# Altium project RGB-mic.PrjPcb
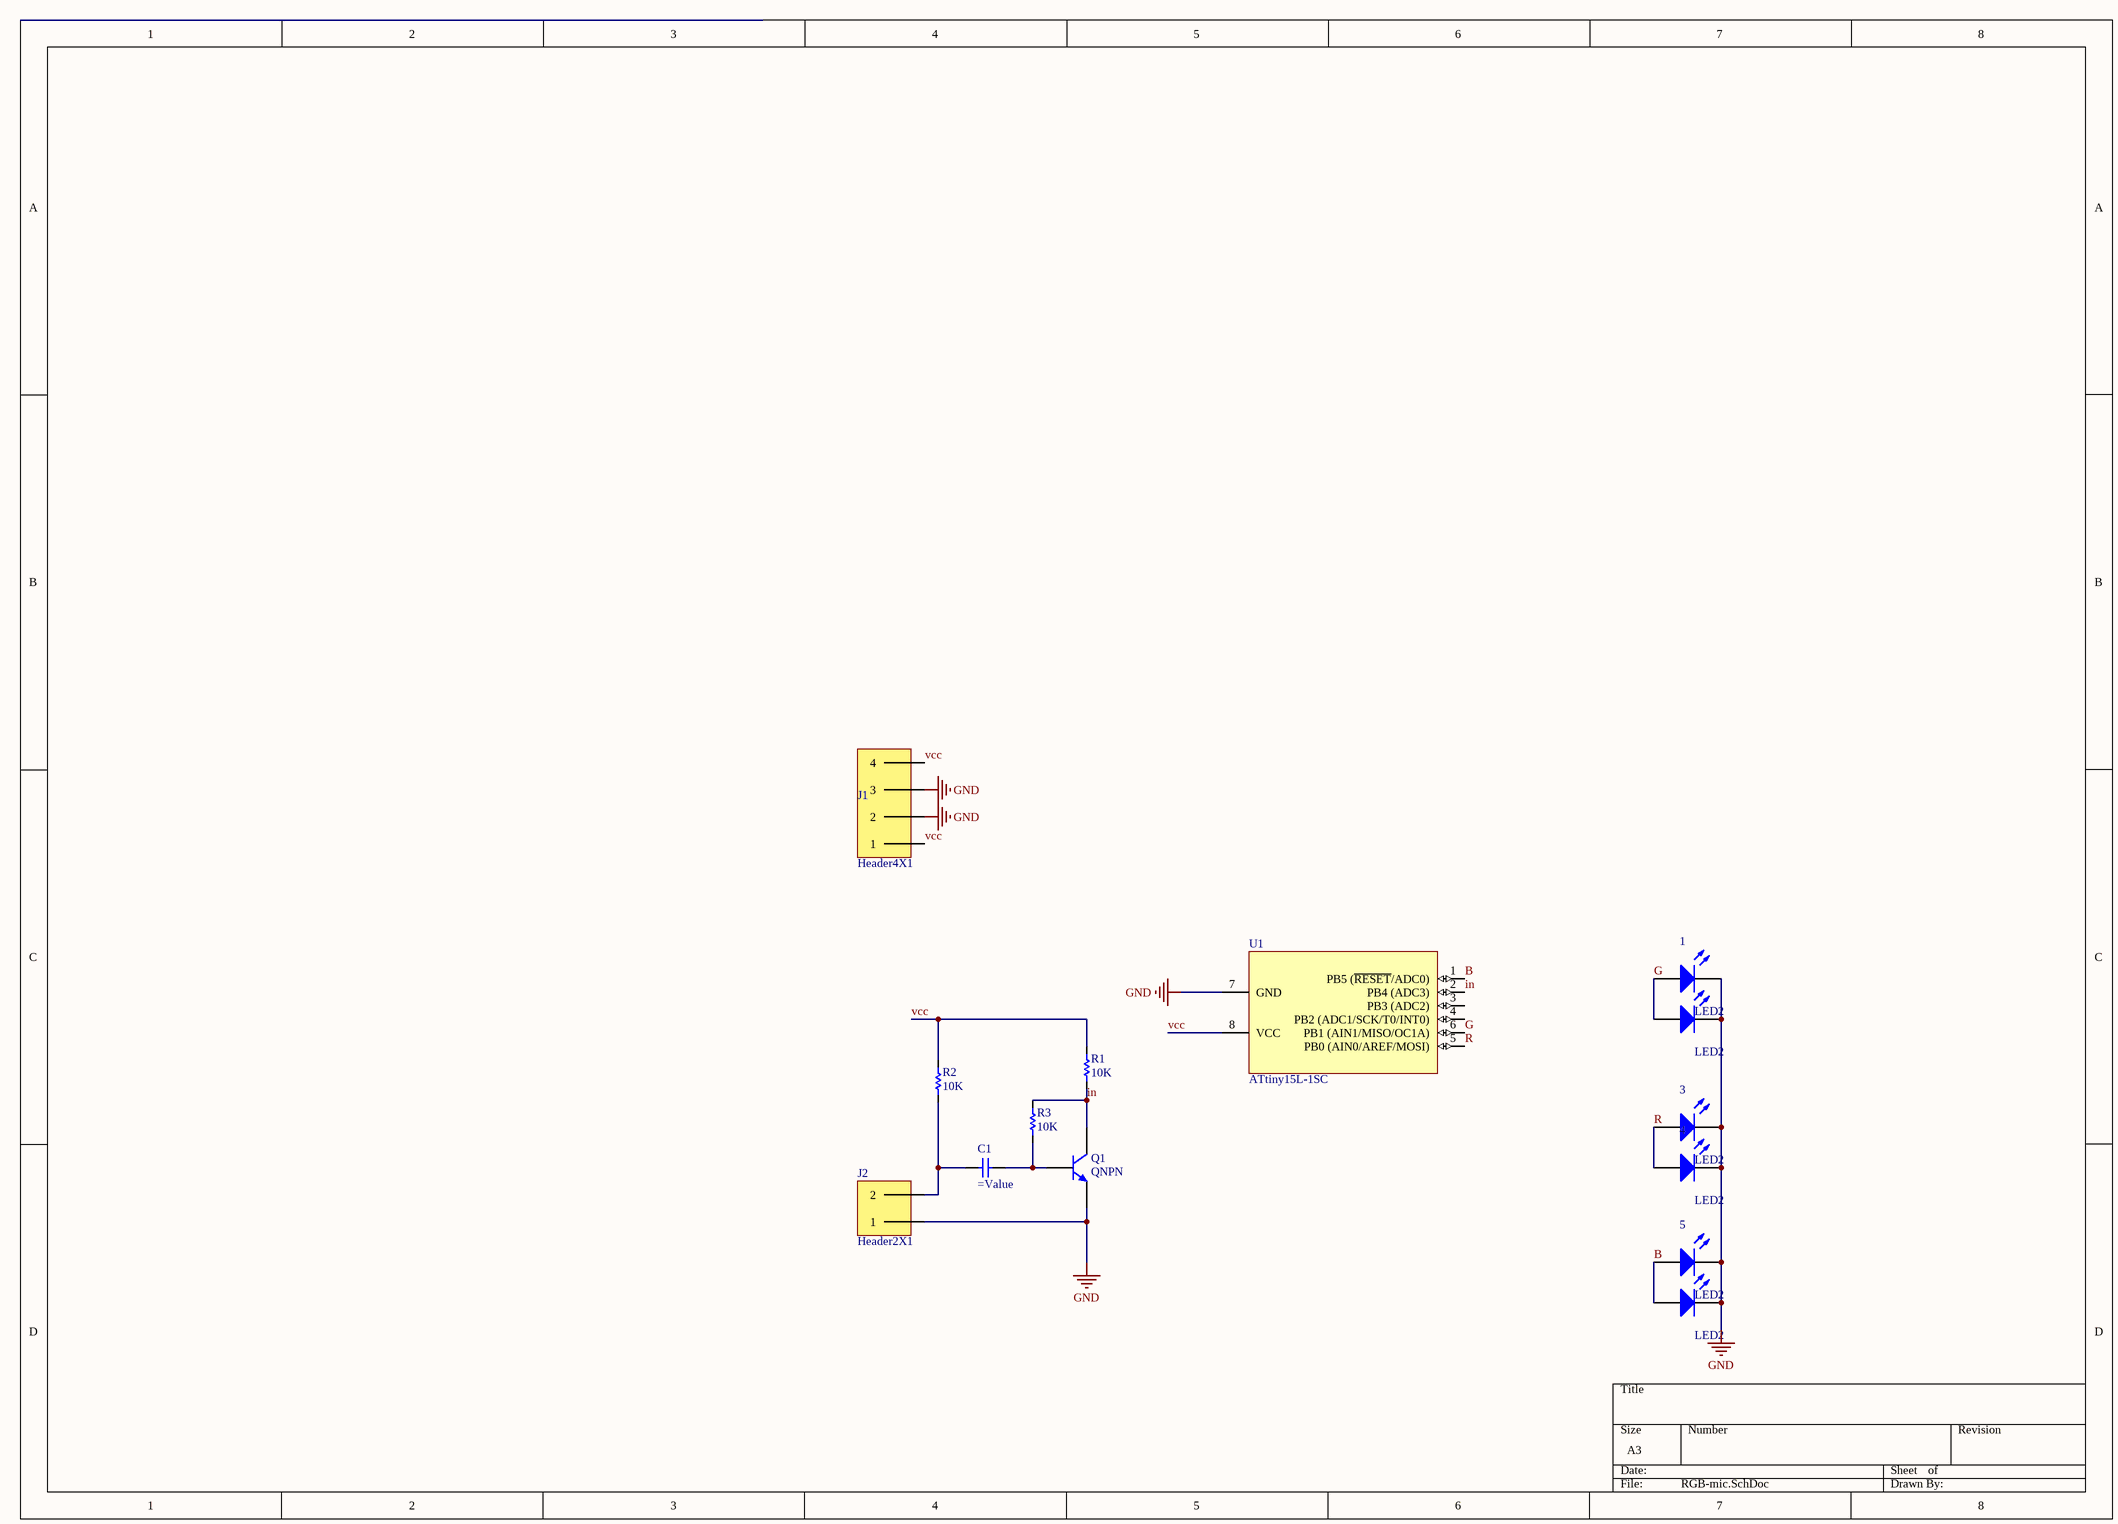
[diagram p0: RGB-mic.SchDoc]
1 sheet, 14 parts. Net scope: global (net labels, ports and power ports of the same name join across sheets).
Board file: RGB-mic.PcbDoc

## Sheet RGB-mic.SchDoc
size A3; SPICEModelCacheRLVYLVLF: <root> / <DocumentId>RLVYLVLF</DocumentId> / <CacheFrame Number="0"> / <Model Name="qnpn" Kind="MDL"> / <Text>*QNPN / *NPN Trans Pinout: C,B,E / .MODEL QNPN NPN(IS=3.2E-16 BF=141 VAF=35 ISE=2.6 NE=1.46 CJE=1E-13 / + MJE=0.333 TF=6E-11 CJC=1E-13 CJS=2.2E-13 MJS=0.5 FC=0.67 )</Text> / </Model> / </CacheFrame> / </root>

### Parts
1  LED2  [RES 0805 (2012X06L)]
2  LED2  [RES 0805 (2012X06L)]
3  LED2  [RES 0805 (2012X06L)]
4  LED2  [RES 0805 (2012X06L)]
5  LED2  [RES 0805 (2012X06L)]
6  LED2  [RES 0805 (2012X06L)]
C1  (no value)  [CAP 1206]
J1  Header4X1  [HEADER 4X1]
J2  Header2X1  [Header 2X1]
Q1  QNPN  [SOT-23B_L]
R1  10K  [RES 1206 (3216X08L)]
R2  10K  [RES 1206 (3216X08L)]
R3  10K  [RES 1206 (3216X08L)]
U1  ATtiny15L-1SC  [8S2_N]

### Nets
GND: 1.2(K) 2.2(K) 3.2(K) 4.2(K) 5.2(K) 6.2(K) J1.2 J1.3 J2.1 Q1.3(E) U1.7(GND)
B: 5.1(A) 6.1(A) U1.1(PB5_(~{RESET}/ADC0))
G: 1.1(A) 2.1(A) U1.6(PB1_(AIN1/MISO/OC1A))
in: Q1.1(C) R1.1 R3.2 U1.2(PB4_(ADC3))
R: 3.1(A) 4.1(A) U1.5(PB0_(AIN0/AREF/MOSI))
vcc: J1.1 J1.4 R1.2 R2.2 U1.8(VCC)
NetC1_1: C1.1(+) J2.2 R2.1
NetC1_2: C1.2(-) Q1.2(B) R3.1

Not connected (* = marked no-connect by the designer): U1 3(PB3_(ADC2)) 4(PB2_(ADC1/SCK/T0/INT0))

### Library data of the parts
1-6 = LED2: Typical RED, GREEN, YELLOW, AMBER GaAs LED; Published: 8-Jun-2000; LatestRevisionDate: 17-Jul-2002; LatestRevisionNote: Re-released for DXP Platform.; PackageVersion: Feb-2002; PackageReference: 3.2X1.6X1.1; Publisher: Altium Limited; PackageDescription: SM LED; 2 Flat Leads
C1 = Capacitor
Q1 = QNPN: NPN Bipolar Transistor; pin to pad: 1>3 2>1 3>2; Published: 8-Jun-2000; LatestRevisionDate: 29-May-2009; LatestRevisionNote: IPC-7351 Footprint Added.; PackageVersion: Aug-1999; PackageReference: SOT-23B; Publisher: Altium Limited; PackageDescription: 3-Pin SOT-23 Package 0.95 mm Pitch, 2.4 mm Lead Span
R1-R3 = Resistor: Tolerance: 5%; Power: 1/4 W; Value: 10K
U1 = ATtiny15L-1SC: 8-Bit AVR Microcontroller with 1K Byte of Flash Memory; pin to pad: 1>7 7>8 8>1; Published: 17-Sep-2003; LatestRevisionDate: 16-Oct-2006; LatestRevisionNote: IPC-7351 Footprint Added.; DatasheetVersion: 1187E-AVR-06/02; PackageVersion: revF, Apr-2008; PackageReference: 8S2; Publisher: Altium Limited; PackageDescription: 8-Lead, 0.208" Body, Plastic Small Outline Package (EIAJ); Supplier 1: Digi-Key; Supplier Part Number 1: ATTINY15L-1SC-ND; Supplier 2: Mouser; Supplier Part Number 2: 556-ATTINY15L1SC; ComponentLink1Description: Datasheet; ComponentLink1URL: http://www.atmel.com/dyn/resources/prod_documents/doc1187.pdf; ComponentLink2Description: Atmel.com Home; ComponentLink2URL: http://www.atmel.com